# EAGLE design Can Bus Shield (EAGLE 7.7.0)
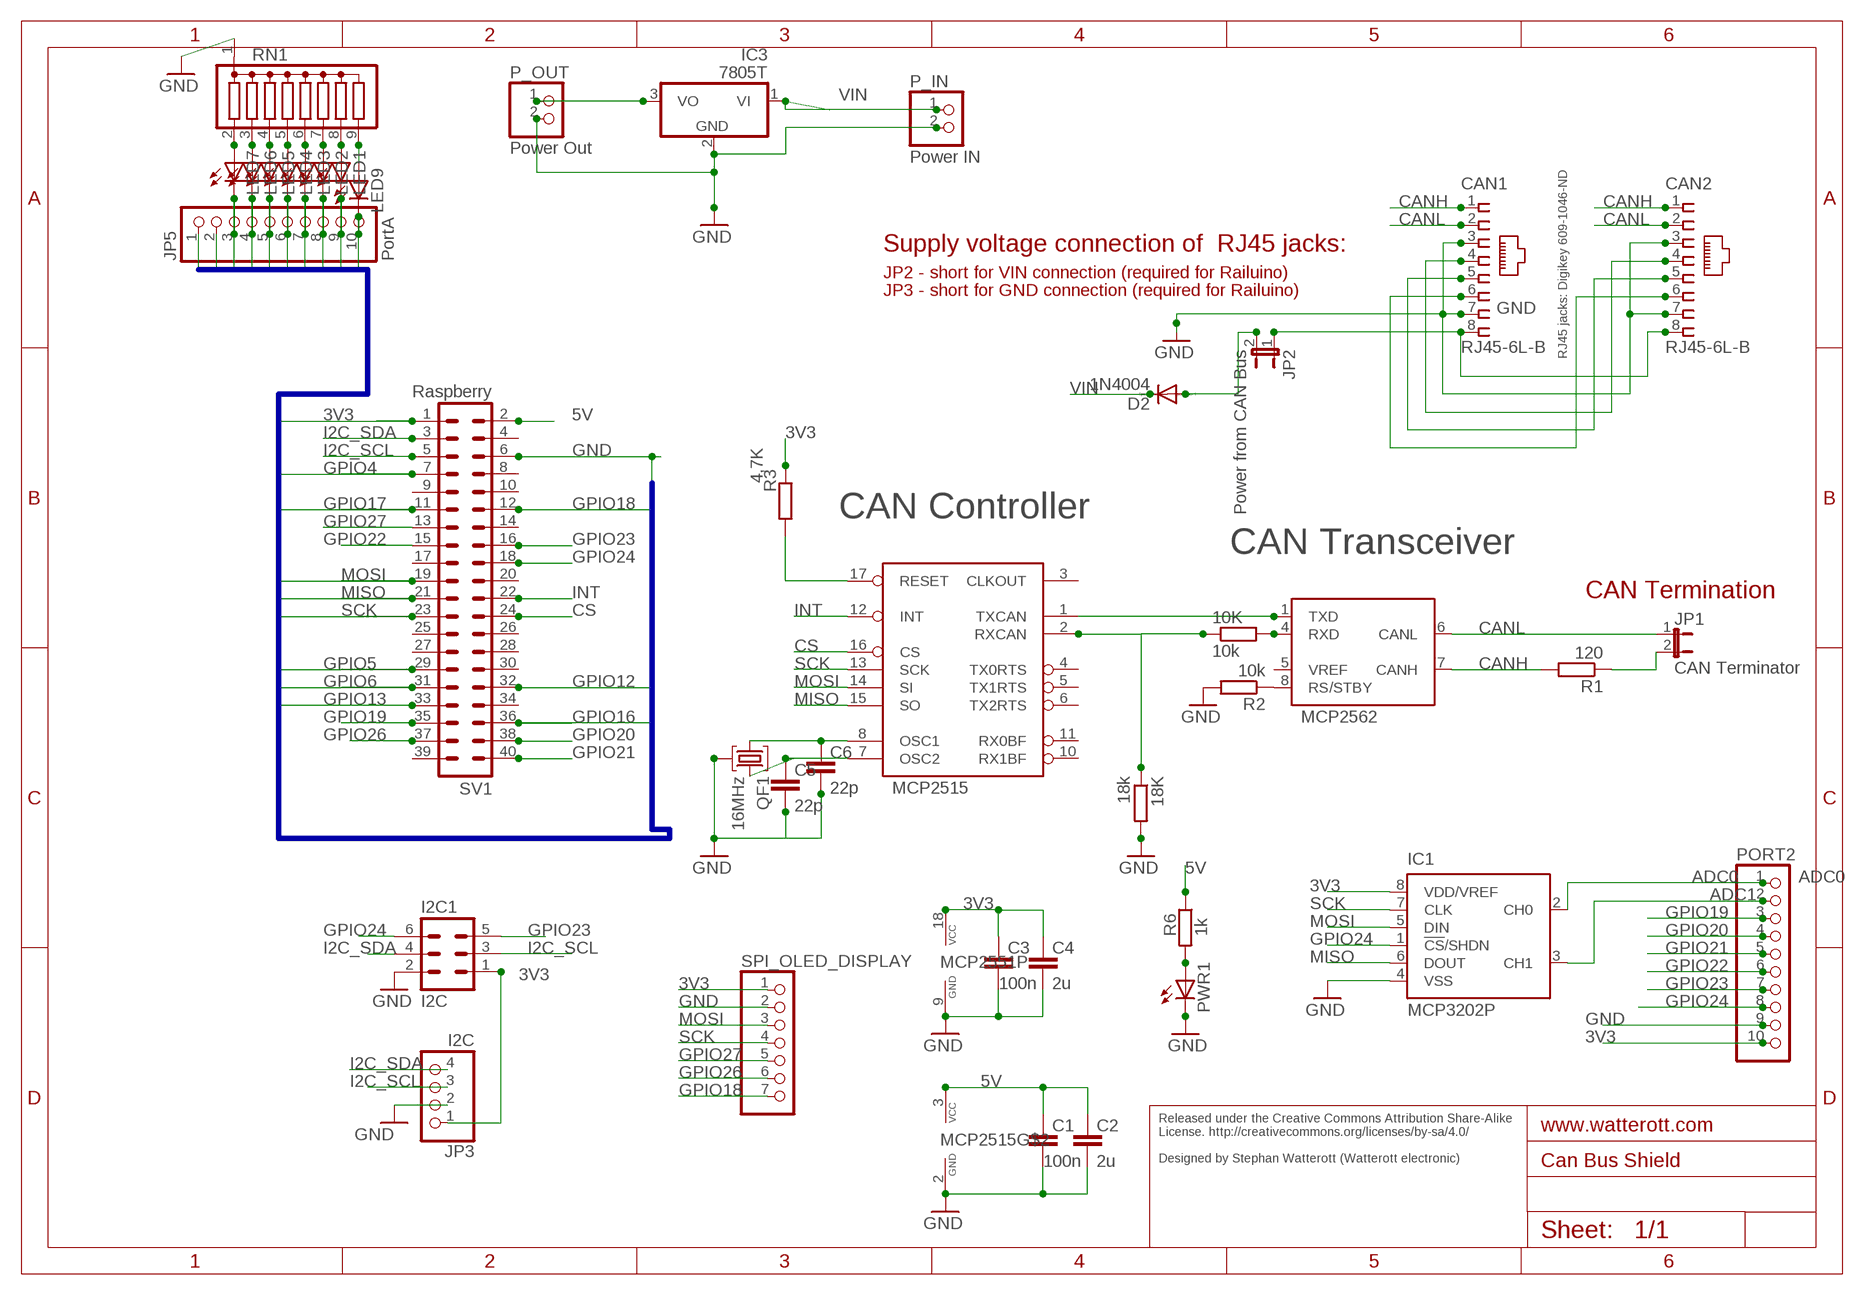
[diagram p0: schematic, sheet 1]

## Parts
10K  10k  R-EU_R2010  [R2010]
18K  18k  R-EU_R2010  [R2010]
C1  100n  C-EUC1812  [C1812]
C2  2u  C-EUC1812  [C1812]
C3  100n  C-EUC1812  [C1812]
C4  2u  C-EUC1812  [C1812]
C5  22p  C-EU025-030X050  [C025-030X050]
C6  22p  C-EU025-025X050  [C025-025X050]
CAN1  RJ45-6L-B  [RJ45-NO-SHIELD]
CAN2  RJ45-6L-B  [RJ45-NO-SHIELD]
D2  1N4004  [DO41-10]
I2C1  I2C  06H  [06H]
IC1  MCP3202P  [DIL8]
IC3  7805T  [TO220H]
JP1  CAN Terminator  JP1E  [JP1]
JP2  Power from CAN Bus  JP1E  [JP1]
JP3  I2C  PINHD-1X4  [1X04]
JP5  PortA  PINHD-1X10  [1X10]
LED1  LEDSML1206  [SML1206]
LED2  LEDSML1206  [SML1206]
LED3  LEDSML1206  [SML1206]
LED4  LEDSML1206  [SML1206]
LED5  LEDSML1206  [SML1206]
LED6  LEDSML1206  [SML1206]
LED7  LEDSML1206  [SML1206]
LED9  LEDSML1206  [SML1206]
MCP2515  MCP2562  MCP2551DIL8  [DIL08]
MCP2551  MCP2515  MCP2515P  [DIL18]
P_IN  Power IN  PINHD-1X2  [1X02]
P_OUT  Power Out  PINHD-1X2  [1X02]
PORT2  PINHD-1X10  [1X10]
PWR1  LEDSMT1206  [1206]
QF1  16MHz  10M7AHC49T  [HC49U]
R1  120  R-EU_R2010  [R2010]
R2  10k  R-EU_R2010  [R2010]
R3  4,7K  R-EU_R2010  [R2010]
R6  1k  R-EU_R2010  [R2010]
RN1  G08R  [SIL9]
SPI_OLED_DISPLAY  PINHD-1X7  [1X07]
SV1  Raspberry  ML40  [ML40]

## Nets
3V3: C3.1 C4.1 I2C1.1 IC1.8(VDD/VREF) JP3.1 JP5.1 MCP2551.18(P:VCC) PORT2.10 R3.1 SPI_OLED_DISPLAY.1 SV1.1
5V: C1.1 C2.1 IC3.3(VO) MCP2515.3(VCC) P_OUT.1 R6.1 SV1.2
ADC0: IC1.2(CH0) PORT2.1
ADC1: IC1.3(CH1) PORT2.2
CAN_TX: MCP2515.1(TXD) MCP2551.1(D:TXCAN)
CANH: CAN1.1 CAN2.1 MCP2515.7(CANH) R1.2
CANL: CAN1.2 CAN2.2 JP1.1 MCP2515.6(CANL)
CS: MCP2551.16(D:CS) SV1.24
GND: 18K.2 C1.2 C2.2 C3.2 C4.2 C5.2 C6.2 CAN1.3 CAN1.7 CAN2.3 CAN2.7 I2C1.2 IC1.4(VSS) IC3.2(GND) JP3.2 JP5.2 MCP2515.2(GND) MCP2551.9(P:GND) P_IN.2 P_OUT.2 PORT2.9 PWR1.C QF1.2 R2.2 RN1.1 SPI_OLED_DISPLAY.2 SV1.6
GPIO4: JP5.10 LED9.C SV1.7
GPIO5: JP5.9 LED1.C SV1.29
GPIO6: JP5.8 LED2.C SV1.31
GPIO12: JP5.7 LED3.C SV1.32
GPIO13: JP5.6 LED4.C SV1.33
GPIO16: JP5.5 LED5.C SV1.36
GPIO17: JP5.4 LED6.C SV1.11
GPIO18: JP5.3 LED7.C SPI_OLED_DISPLAY.7 SV1.12
GPIO19: PORT2.3 SV1.35
GPIO20: PORT2.4 SV1.38
GPIO21: PORT2.5 SV1.40
GPIO22: PORT2.6 SV1.15
GPIO23: I2C1.5 PORT2.7 SV1.16
GPIO24: I2C1.6 IC1.1(!CS!/SHDN) PORT2.8 SV1.18
GPIO26: SPI_OLED_DISPLAY.6 SV1.37
GPIO27: SPI_OLED_DISPLAY.5 SV1.13
I2C_SCL: I2C1.3 JP3.3 SV1.5
I2C_SDA: I2C1.4 JP3.4 SV1.3
INT: MCP2551.12(D:INT) SV1.22
MISO: IC1.6(DOUT) MCP2551.15(D:SO) SV1.21
MOSI: IC1.5(DIN) MCP2551.14(D:SI) SPI_OLED_DISPLAY.3 SV1.19
N$1: 10K.1 18K.1 MCP2551.2(D:RXCAN)
N$2: LED9.A RN1.9
N$3: LED1.A RN1.8
N$4: LED2.A RN1.7
N$5: LED3.A RN1.6
N$6: CAN1.8 CAN2.8 JP2.1
N$7: MCP2515.8(RS) R2.1
N$8: LED4.A RN1.5
N$9: JP1.2 R1.1
N$10: LED5.A RN1.4
N$11: LED6.A RN1.3
N$12: LED7.A RN1.2
N$13: MCP2551.17(D:RESET) R3.2
N$15: 10K.2 MCP2515.4(RXD)
N$22: PWR1.A R6.2
N$121: D2.A JP2.2
N$199: CAN1.4 CAN2.4
N$200: CAN1.5 CAN2.5
N$201: CAN1.6 CAN2.6
OSC1: C6.1 MCP2551.8(D:OSC1) QF1.1
OSC2: C5.1 MCP2551.7(D:OSC2) QF1.3
SCK: IC1.7(CLK) MCP2551.13(D:SCK) SPI_OLED_DISPLAY.4 SV1.23
VIN: D2.C IC3.1(VI) P_IN.1
Unconnected: MCP2515.5(VREF) MCP2551.3(D:CLKOUT) MCP2551.4(D:TX0RTS) MCP2551.5(D:TX1RTS) MCP2551.6(D:TX2RTS) MCP2551.10(D:RX1BF) MCP2551.11(D:RX0BF) SV1.4 SV1.8 SV1.9 SV1.10 SV1.14 SV1.17 SV1.20 SV1.25 SV1.26 SV1.27 SV1.28 SV1.30 SV1.34 SV1.39

## Buses
GPIO4,GPIO5,GPIO6,GPIO12,GPIO13,GPIO16,GPIO17,GPIO18,MOSI,MISO,SCK,GND,3V3

## Notes on the sheet
- Supply voltage connection of  RJ45 jacks:
- JP2 - short for VIN connection (required for Railuino)
- JP3 - short for GND connection (required for Railuino)
- RJ45 jacks: Digikey 609-1046-ND
- CAN Controller
- CAN Transceiver
- CAN Termination
- /STBY
- Released under the Creative Commons Attribution Share-Alike 
  License. http://creativecommons.org/licenses/by-sa/4.0/
  
  Designed by Stephan Watterott (Watterott electronic)

## Library data of the parts
10K 18K R1 R2 = resistor:R-EU_: RESISTOR, European symbol
C1-C6 = resistor:C-EU: CAPACITOR, European symbol
CAN1 CAN2 = con-tycoelectronics:RJ45: CORCOM Modular RJ Jacks No Shield Source: www.tycoelectronics.com .. ENG_DS_1654001_1099_RJ_L_0507.pdf; MPN: RJ45-6L-B; OC_FARNELL: unknown; OC_NEWARK: 16R6090
D2 = diode:1N4004: DIODE general purpose rectifier, 1 A
I2C1 = con-harting-h:06H: CONNECTOR; OC_FARNELL: unknown; OC_NEWARK: unknown
IC1 = microchip:MCP3202: 2.7V Dual Channel 12-Bit A/D Converter with SPI Serial Interface Source: http://ww1.microchip.com/downloads/en/DeviceDoc/21034D.pdf; MF: MICROCHIP; MPN: MCP3202-CI/P; OC_FARNELL: 1196794; OC_NEWARK: 72K7287
IC3 = linear:78*: Positive VOLTAGE REGULATOR Source: http://cache.national.com/ds/LM/LM78L05.pdf http://www.fairchildsemi.com/ds/LM/LM7805.pdf
JP1 JP2 = jumper:JP1E: JUMPER
JP3 = pinhead:PINHD-1X4: PIN HEADER
JP5 PORT2 = pinhead:PINHD-1X10: PIN HEADER
LED1-LED7 LED9 PWR1 = led:LED: LED OSRAM: - CHIPLED LG R971, LG N971, LY N971, LG Q971, LY Q971, LO R971, LY R971 LH N974, LH R974 LS Q976, LO Q976, LY Q976 LO Q996 - Hyper CHIPLED LW Q18S LB Q993, LB Q99A, LB R99A - SideLED LS A670, LO A670, LY A670, LG A670, LP A670 LB A673, LV A673, LT A673, LW A673 LH A674 LY A675 LS A676, LA A676, LO A676, LY A676, LW A676 LS A679, LY A679, LG A679 - Hyper Micro SIDELED® LS Y876, LA Y876, LO Y876, LY Y876 LT Y87S - SmartLED LW L88C, LW L88S LB L89C, LB L89S, LG L890 LS L89K, LO L89K, LY L89K LS L896, LA L896, LO L896, LY L896 - TOPLED LS T670, LO T670, LY T670, LG T670, LP T670 LSG T670, LSP T670, LSY T670, LOP T670, LYG T670 LG T671, LOG T671, LSG T671 LB T673, LV T673, LT T673, LW T673 LH T674 LS T676, LA T676, LO T676, LY T676, LB T676, LH T676, LSB T676, LW T676 LB T67C, LV T67C, LT T67C, LS T67K, LO T67K, LY T67K, LW E67C LS E67B, LA E67B, LO E67B, LY E67B, LB E67C, LV E67C, LT E67C LW T67C LS T679, LY T679, LG T679 LS T770, LO T770, LY T770, LG T770, LP T770 LB T773, LV T773, LT T773, LW T773 LH T774 LS E675, LA E675, LY E675, LS T675 LS T776, LA T776, LO T776, LY T776, LB T776 LHGB T686 LT T68C, LB T68C - Hyper Mini TOPLED® LB M676 - Mini TOPLED Santana® LG M470 LS M47K, LO M47K, LY M47K Source: http://www.osram.convergy.de LUXEON: - LUMILED® LXK2-PW12-R00, LXK2-PW12-S00, LXK2-PW14-U00, LXK2-PW14-V00 LXK2-PM12-R00, LXK2-PM12-S00, LXK2-PM14-U00 LXK2-PE12-Q00, LXK2-PE12-R00, LXK2-PE12-S00, LXK2-PE14-T00, LXK2-PE14-U00 LXK2-PB12-K00, LXK2-PB12-L00, LXK2-PB12-M00, LXK2-PB14-N00, LXK2-PB14-P00, LXK2-PB14-Q00 LXK2-PR12-L00, LXK2-PR12-M00, LXK2-PR14-Q00, LXK2-PR14-R00 LXK2-PD12-Q00, LXK2-PD12-R00, LXK2-PD12-S00 LXK2-PH12-R00, LXK2-PH12-S00 LXK2-PL12-P00, LXK2-PL12-Q00, LXK2-PL12-R00 Source: www.luxeon.com KINGBRIGHT: KA-3528ASYC Source: www.kingbright.com
MCP2515 = can:MCP2551: CAN Tranceiver Microchip
MCP2551 = can:MCP2515: MC2515 Stand-Alone CAN Controller With SPI Interface, Microchip
P_IN P_OUT = pinhead:PINHD-1X2: PIN HEADER
QF1 = crystal:10M*A: Monolithic Crystal Filters Source: www.vanlong.com; OC_FARNELL: unknown; OC_NEWARK: unknown
R3 R6 = rcl:R-EU_: RESISTOR, European symbol
RN1 = resistor-sil:G08R: SIL RESISTOR; OC_FARNELL: unknown; OC_NEWARK: unknown
SPI_OLED_DISPLAY = pinhead:PINHD-1X7: PIN HEADER
SV1 = con-harting-ml:ML40: HARTING; OC_FARNELL: unknown; OC_NEWARK: unknown

## Board
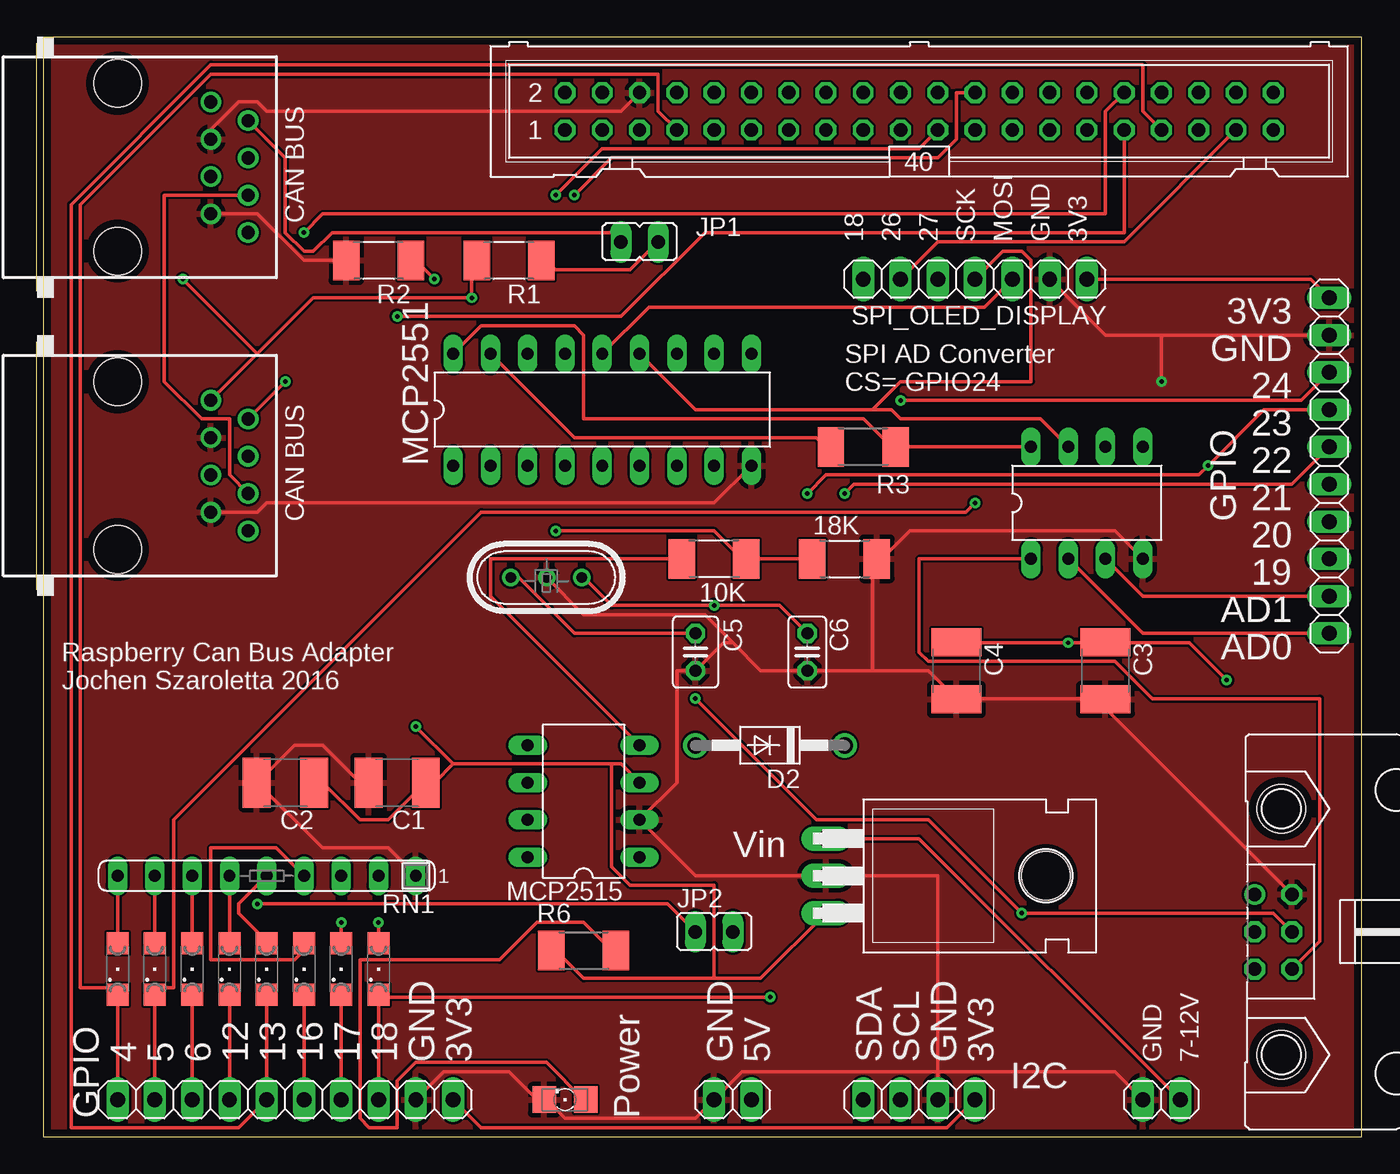
[diagram p1: board, top side]
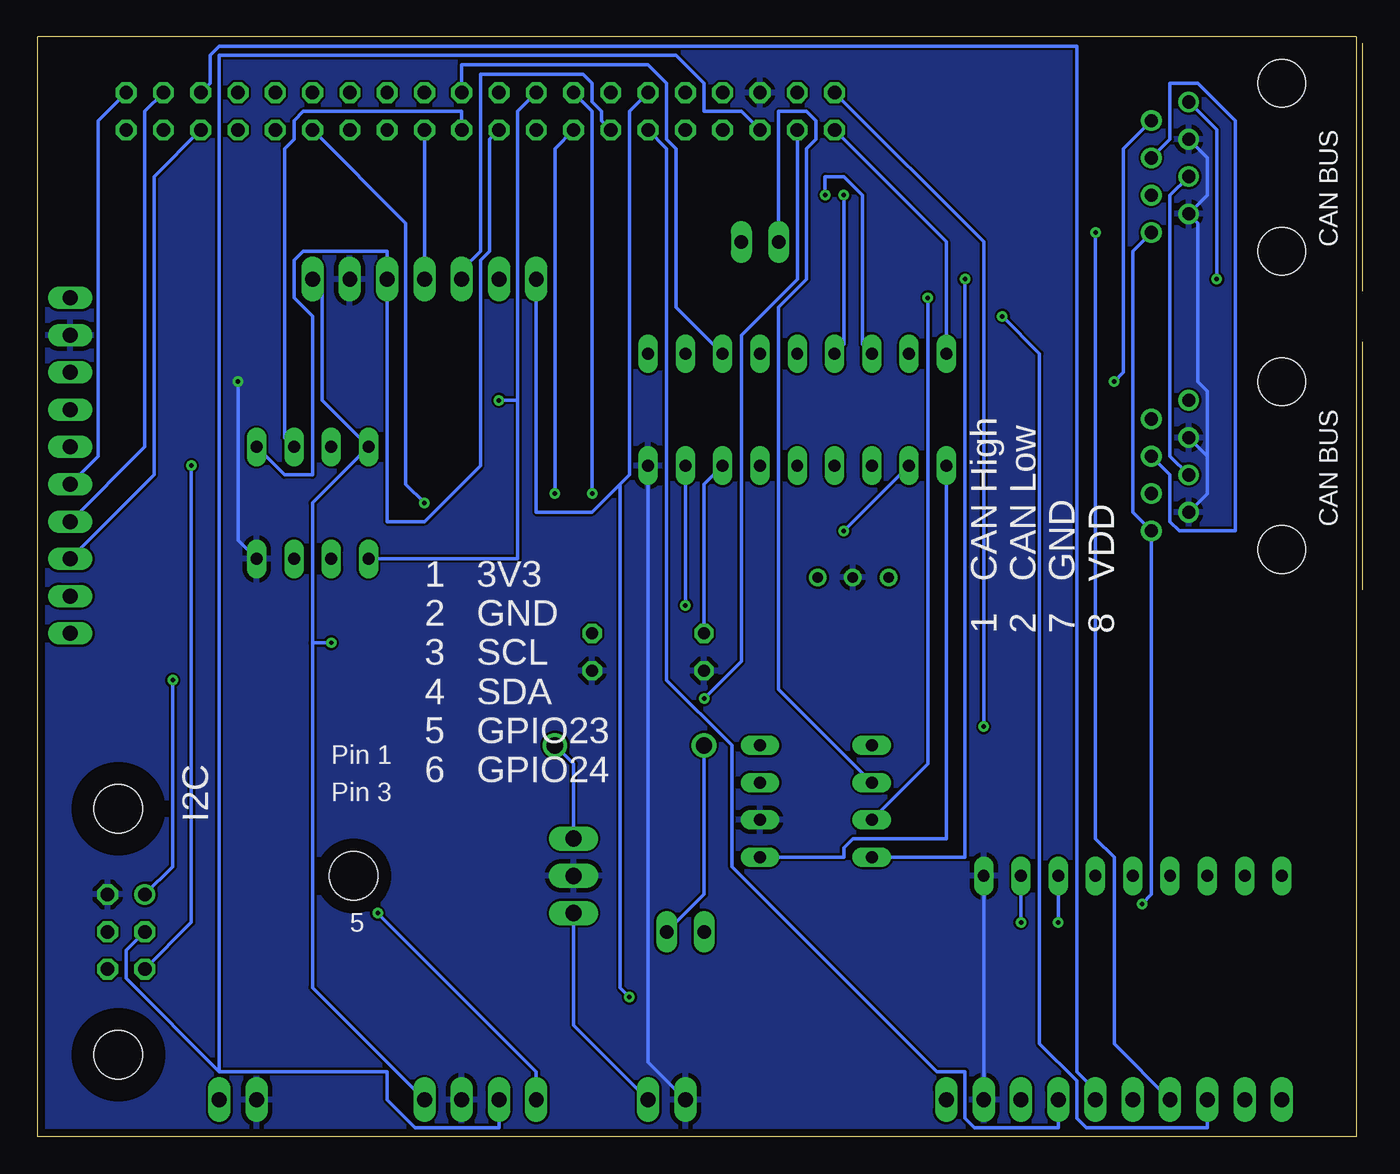
[diagram p2: board, bottom side, seen from below]

Size 90.27 x 74.93 mm. Coordinates in mm from the lower left corner, seen from the top.
Outline: 90.27,74.92 90.27,0 0.43,0 0.43,74.92
Outline: 0.43,74.93 90.27,74.93
Copper layers (1*16): Top 0.035mm / dielectric 1.6mm / Bottom 0.035mm
Design rules "Elecrow_2-layer_PCB_eagle_rule_Jochen1": minimum track width 10mil, minimum drill 12mil, track to track 6mil, track to pad 6mil, pad to pad 6mil, via to via 10mil, smd to smd 0mil, copper to edge 20mil, drill to drill 10mil, minimum pad ring 10mil, minimum via ring 8mil, stop-mask expansion 0mil, vias tented up to drill 100mil, thermal gap 12mil
vRestrict: area 33.5,64.8 to 86.8,72.4; area 84.3,34.3 to 90.6,59.7; area 3,5.1 to 30.9,11.4; area 43.6,5.1 to 51.2,8.9; area 52.5,5.1 to 60.1,8.9; area 60.1,5.1 to 67.7,8.9; area 9.3,59.7 to 15.7,72.4; area 10.6,39.4 to 15.7,52.1; area 81.7,10.2 to 86.8,19.1; area 27.1,43.2 to 50,55.9; area 51.2,12.7 to 57.6,22.9; area 65.2,36.8 to 76.6,49.5; area 43.6,0 to 67.7,5.1; area 80.4,31.8 to 85.5,59.7; area 50,59.7 to 69,64.8; area 37.3,62.2 to 53.8,64.8; area 3,8.9 to 27.1,14; area 1.7,29.2 to 30.9,34.3; area 15.7,62.2 to 19.5,72.4; area 15.7,40.6 to 19.5,50.8; area 29.6,15.2 to 43.6,19.1; area 72.8,5.1 to 80.4,10.2; area 52.5,44.5 to 60.1,48.3; area 70.3,10.2 to 80.4,14; area 53.8,50.8 to 72.8,57.2; area 42.3,10.2 to 65.2,12.7; area 38.5,0 to 42.3,8.9

### Footprints (pad centres in the part's own frame; a part is rotated, then mirrored left to right if it is on the bottom)
R2010 = smd 1.8 x 2.7: 1 -2.2,0; 2 2.2,0
C1812 = smd 1.9 x 3.4: 1 -1.95,0; 2 1.95,0
C025-030X050 = drill 0.813 octagon: 1 -1.27,0; 2 1.27,0
C025-025X050 = drill 0.813 octagon: 1 -1.27,0; 2 1.27,0
RJ45-NO-SHIELD = drill 0.9 pad 1.4: 1 -4.445,6.35; 2 -3.175,8.89; 3 -1.905,6.35; 4 -0.635,8.89; 5 0.635,6.35; 6 1.905,8.89; 7 3.175,6.35; 8 4.445,8.89 | hole 3.251: -5.715,0; 5.715,0
DO41-10 = drill 1.118: A 5.08,0; C -5.08,0
06H = drill 0.914: 1 -2.54,-1.27 | drill 0.914 octagon: 2 -2.54,1.27; 3 0,-1.27; 4 0,1.27; 5 2.54,-1.27; 6 2.54,1.27 | hole 3.302: -8.382,0.533; 8.382,0.533
DIL8 = drill 0.813 long: 1 -3.81,-3.81; 2 -1.27,-3.81; 3 1.27,-3.81; 4 3.81,-3.81; 5 3.81,3.81; 6 1.27,3.81; 7 -1.27,3.81; 8 -3.81,3.81
TO220H = drill 1.118 long: 1 -2.54,-10.16; 2 0,-10.16; 3 2.54,-10.16 | hole 3.302: 0,4.826
JP1 = drill 0.914 long: 1 0,-1.27; 2 0,1.27
1X04 = drill 1.016 long: 1 -3.81,0; 2 -1.27,0; 3 1.27,0; 4 3.81,0
1X10 = drill 1.016 long: 1 -11.43,0; 2 -8.89,0; 3 -6.35,0; 4 -3.81,0; 5 -1.27,0; 6 1.27,0; 7 3.81,0; 8 6.35,0; 9 8.89,0; 10 11.43,0
SML1206 = smd 1.5 x 1.5: A 1.75,0; C -1.75,0
DIL08 = drill 0.813 long: 1 -3.81,-3.81; 2 -1.27,-3.81; 3 1.27,-3.81; 4 3.81,-3.81; 5 3.81,3.81; 6 1.27,3.81; 7 -1.27,3.81; 8 -3.81,3.81
DIL18 = drill 0.813 long: 1 -10.16,-3.81; 2 -7.62,-3.81; 3 -5.08,-3.81; 4 -2.54,-3.81; 5 0,-3.81; 6 2.54,-3.81; 7 5.08,-3.81; 8 7.62,-3.81; 9 10.16,-3.81; 10 10.16,3.81; 11 7.62,3.81; 12 5.08,3.81; 13 2.54,3.81; 14 0,3.81; 15 -2.54,3.81; 16 -5.08,3.81; 17 -7.62,3.81; 18 -10.16,3.81
1X02 = drill 1.016 long: 1 -1.27,0; 2 1.27,0
1206 = smd 1.6 x 1.803: A -1.422,0; C 1.422,0
HC49U = drill 0.7 pad 1.2: 1 -2.413,0; 2 -0.027,0; 3 2.413,0
SIL9 = drill 0.813 long: 1 -10.16,0; 2 -7.62,0; 3 -5.08,0; 4 -2.54,0; 5 0,0; 6 2.54,0; 7 5.08,0; 8 7.62,0; 9 10.16,0
1X07 = drill 1.016 long: 1 -7.62,0; 2 -5.08,0; 3 -2.54,0; 4 0,0; 5 2.54,0; 6 5.08,0; 7 7.62,0
ML40 = drill 0.914 octagon: 1 -24.13,-1.27; 2 -24.13,1.27; 3 -21.59,-1.27; 4 -21.59,1.27; 5 -19.05,-1.27; 6 -19.05,1.27; 7 -16.51,-1.27; 8 -16.51,1.27; 9 -13.97,-1.27; 10 -13.97,1.27; 11 -11.43,-1.27; 12 -11.43,1.27; 13 -8.89,-1.27; 14 -8.89,1.27; 15 -6.35,-1.27; 16 -6.35,1.27; 17 -3.81,-1.27; 18 -3.81,1.27; 19 -1.27,-1.27; 20 -1.27,1.27; 21 1.27,-1.27; 22 1.27,1.27; 23 3.81,-1.27; 24 3.81,1.27; 25 6.35,-1.27; 26 6.35,1.27; 27 8.89,-1.27; 28 8.89,1.27; 29 11.43,-1.27; 30 11.43,1.27; 31 13.97,-1.27; 32 13.97,1.27; 33 16.51,-1.27; 34 16.51,1.27; 35 19.05,-1.27; 36 19.05,1.27; 37 21.59,-1.27; 38 21.59,1.27; 39 24.13,-1.27; 40 24.13,1.27

### Placement (x,y rotation side)
10K  46.15,39.37 180 top
18K  55.04,39.37 0 top
C1  24.56,24.13 180 top
C2  16.94,24.13 180 top
C3  72.82,31.75 270 top
C4  62.66,31.75 270 top
C5  44.88,33.02 270 top
C6  52.5,33.02 270 top
CAN1  5.51,45.72 270 top
CAN2  5.51,66.04 270 top
D2  49.96,26.67 180 top
I2C1  84.25,13.97 270 top
IC1  71.55,43.18 0 top
IC3  63.93,17.78 270 top
JP1  41.07,60.96 270 top
JP2  46.15,13.97 270 top
JP3  60.12,2.54 180 top
JP5  16.94,2.54 180 top
LED1  8.05,11.43 90 top
LED2  10.59,11.43 90 top
LED3  13.13,11.43 90 top
LED4  15.67,11.43 90 top
LED5  18.21,11.43 90 top
LED6  20.75,11.43 90 top
LED7  23.29,11.43 90 top
LED9  5.51,11.43 90 top
MCP2515  37.26,22.86 90 top
MCP2551  38.53,49.53 0 top
P_IN  76.63,2.54 180 top
P_OUT  47.42,2.54 180 top
PORT2  88.06,45.72 90 top
PWR1  35.99,2.54 180 top
QF1  34.72,38.1 180 top
R1  32.18,59.69 180 top
R2  23.29,59.69 180 top
R3  56.31,46.99 180 top
R6  37.26,12.7 0 top
RN1  15.67,17.78 180 top
SPI_OLED_DISPLAY  63.93,58.42 180 top
SV1  60.12,69.85 0 top

### Tracks (layer width: path | path; a pad name or v marks a point on that pad's centre or on a via)
3V3  (via drill 0.3)
  Top 0.254: v81.08,31.12 78.54,33.66 72.82,33.66 | 72.82,33.66 v70.28,33.66 62.66,33.66 C4.1 | 72.82,33.66 C3.1 | JP5.1 30.28,0.63 62.03,0.63 JP3.1 | IC1.8 R3.1 58.22,46.99 56.31,48.89 37.26,48.89 37.26,54.61 36.63,55.25 30.28,55.25 MCP2551.18 | PORT2.10 86.79,58.42 SPI_OLED_DISPLAY.1
  Bottom 0.254: I2C1.1 81.08,18.41 v81.08,31.12 | MCP2551.18 28.37,60.96 SV1.1 | SPI_OLED_DISPLAY.1 70.92,57.78 70.92,50.16 IC1.8 71.55,43.18 71.55,33.66 | JP3.1 71.55,10.16 71.55,33.66 | 71.55,33.66 v70.28,33.66
5V  (via drill 0.3)
  Top 0.254: 46.15,10.79 49.33,10.79 IC3.3 | 46.15,10.79 37.26,10.79 35.36,12.7 R6.1 | MCP2515.3 39.8,25.4 39.17,25.4 | 28.37,25.4 39.17,25.4 | 28.37,25.4 27.1,24.13 C1.1 26.47,24.13 23.93,21.59 22.02,21.59 19.48,24.13 C2.1 | 28.37,25.4 v25.83,27.94 | 46.15,10.79 46.15,17.14 40.44,17.14 39.17,18.41 39.17,25.4
  Bottom 0.254: P_OUT.1 53.77,7.62 IC3.3 | SV1.2 25.83,60.96 v25.83,27.94
ADC0
  Top 0.254: IC1.2 75.36,34.29 PORT2.1
ADC1
  Top 0.254: IC1.3 75.36,36.83 PORT2.2
CAN_TX
  Bottom 0.254: MCP2515.1 35.36,19.05 35.36,19.68 34.72,20.32 28.37,20.32 MCP2551.1
CANH  (via drill 0.3)
  Top 0.254: R1.2 29.64,59.69 v29.64,57.15 18.85,57.15 15.04,53.34 | 15.04,53.34 CAN1.1 | 15.04,53.34 v9.96,58.42
  Bottom 0.254: MCP2515.7 29.64,25.4 v29.64,57.15 | CAN2.1 9.96,68.58 v9.96,58.42
CANL  (via drill 0.3)
  Top 0.254: v16.94,51.44 CAN1.2 | CAN2.2 16.94,66.67 16.94,61.59 18.21,60.33 18.85,60.33 20.12,61.59 39.17,61.59 JP1.1
  Bottom 0.254: v16.94,51.44 16.31,52.07 16.31,67.31 CAN2.2 | MCP2515.6 39.8,30.48 39.8,56.52 37.9,58.42 37.9,67.31 37.26,67.94 37.26,69.22 37.9,69.85 39.8,69.85 JP1.1
CS  (via drill 0.3)
  Top 0.254: v36.63,64.14 39.17,66.67 61.39,66.67 62.66,67.94 62.66,71.12 SV1.24
  Bottom 0.254: MCP2551.16 34.09,53.98 34.09,64.14 35.36,65.41 36.63,65.41 v36.63,64.14
GND  (via drill 0.3)
  Top 0.254: R2.2 18.21,59.69 15.04,62.86 CAN2.7 | SV1.6 39.8,69.85 15.67,69.85 15.04,70.48 13.77,70.48 11.86,68.58 CAN2.3 | MCP2551.9 46.15,43.18 15.67,43.18 15.04,42.55 CAN1.7 | 15.04,24.13 17.58,26.67 19.48,26.67 22.02,24.13 C1.2 | JP5.2 27.74,4.45 32.18,4.45 34.09,2.54 PWR1.C 34.72,2.54 35.99,1.27 44.88,1.27 P_OUT.2 48.06,4.45 61.39,4.45 | 15.04,24.13 19.48,19.68 23.93,19.68 RN1.1 | 15.04,24.13 C2.2 | 61.39,4.45 61.39,17.78 IC3.2 44.88,17.78 MCP2515.2 43.61,24.13 43.61,31.75 C5.2 46.79,33.66 47.42,33.66 | 61.39,4.45 JP3.2 | P_IN.2 73.46,4.45 61.39,4.45 | I2C1.2 72.82,29.21 C3.2 72.82,29.84 62.66,29.84 | SPI_OLED_DISPLAY.2 72.82,54.61 76.63,54.61 | PORT2.9 76.63,54.61 | IC1.4 73.46,41.27 59.49,41.27 57.58,39.37 18K.2 56.95,39.37 56.95,31.75 | 47.42,33.66 49.33,31.75 C6.2 56.95,31.75 | 47.42,33.66 45.52,35.56 37.26,35.56 34.72,38.1 QF1.2 | v76.63,51.44 76.63,54.61 | 62.66,29.84 60.76,31.75 56.95,31.75 | 62.66,29.84 C4.2
  Bottom 0.254: CAN2.3 10.59,66.67 10.59,64.14 CAN2.7 11.23,62.23 11.23,51.44 10.59,50.8 10.59,46.35 | 10.59,46.35 CAN1.3 | 10.59,46.35 10.59,43.81 CAN1.7 | JP5.2 RN1.1 | v76.63,51.44 76.63,40.64 IC1.4 | MCP2551.9 48.69,5.08 P_OUT.2
  pour Bottom: 0.43,74.93 90.6,74.93 90.6,0 0.43,0
  pour Top: 0.43,74.93 90.6,74.93 90.6,0 0.43,0 0.43,1.27
GPIO4
  Top 0.254: JP5.10 LED9.C 5.51,10.16 2.97,10.16 2.97,63.5 11.86,72.39 42.34,72.39 42.34,69.85 SV1.7
GPIO5  (via drill 0.3)
  Top 0.254: JP5.9 LED1.C 8.05,10.16 9.32,10.16 9.32,21.59 30.28,42.55 63.3,42.55 v63.93,43.18
  Bottom 0.254: SV1.29 65.2,62.23 65.2,44.45 v63.93,43.18
GPIO6  (via drill 0.3)
  Top 0.254: JP5.8 LED2.C | SV1.31 74.09,61.59 45.52,61.59 39.8,55.88 v24.56,55.88
  Bottom 0.254: v24.56,55.88 22.02,53.34 22.02,6.35 19.48,3.81 19.48,1.27 18.85,0.63 10.59,0.63 JP5.8
GPIO12  (via drill 0.3)
  Top 0.254: JP5.7 LED3.C | SV1.32 72.82,69.85 72.82,62.86 19.48,62.86 v18.21,61.59
  Bottom 0.254: v18.21,61.59 18.21,20.32 16.94,19.05 16.94,6.35 JP5.7
GPIO13
  Top 0.254: LED4.C JP5.6 13.77,0.63 2.34,0.63 2.34,63.5 11.86,73.03 75.36,73.03 75.36,69.85 SV1.33
GPIO16
  Top 0.254: JP5.5 LED5.C
  Bottom 0.254: SV1.36 78.54,71.75 78.54,73.66 77.9,74.3 19.48,74.3 19.48,4.45 18.21,3.17 JP5.5
GPIO17
  Top 0.254: JP5.4 LED6.C
  Bottom 0.254: SV1.11 47.42,67.31 47.42,31.12 42.98,26.67 42.98,18.41 29.01,4.45 27.1,4.45 27.1,1.27 26.47,0.63 20.75,0.63 JP5.4
GPIO18  (via drill 0.3)
  Top 0.254: JP5.3 23.29,9.52 | v49.96,9.52 23.29,9.52 | 23.29,9.52 LED7.C
  Bottom 0.254: SV1.12 49.96,69.85 49.96,45.09 50.6,44.45 | 50.6,44.45 52.5,42.55 56.31,42.55 SPI_OLED_DISPLAY.7 | v49.96,9.52 50.6,10.16 50.6,44.45
GPIO19
  Bottom 0.254: SV1.35 82.35,65.41 82.35,45.09 PORT2.3
GPIO20
  Bottom 0.254: SV1.38 82.98,69.85 82.98,46.99 PORT2.4
GPIO21
  Bottom 0.254: SV1.40 86.16,69.22 86.16,46.35 PORT2.5
GPIO22  (via drill 0.3)
  Top 0.254: v55.04,43.81 55.68,44.45 85.52,44.45 PORT2.6
  Bottom 0.254: SV1.15 55.04,67.31 v55.04,43.81
GPIO23  (via drill 0.3)
  Top 0.254: PORT2.7 83.62,49.53 v79.81,45.72 79.17,45.09 53.77,45.09 v52.5,43.81
  Bottom 0.254: I2C1.5 79.81,14.61 v79.81,45.72 | SV1.16 52.5,69.85 v52.5,43.81
GPIO24  (via drill 0.3)
  Top 0.254: I2C1.6 87.43,13.34 87.43,29.84 76,29.84 73.46,32.38 60.76,32.38 60.12,33.02 60.12,39.37 IC1.1 | PORT2.8 86.16,50.16 v58.85,50.16
  Bottom 0.254: IC1.1 57.58,39.37 57.58,50.16 | 57.58,50.16 57.58,69.85 SV1.18 | 57.58,50.16 v58.85,50.16
GPIO26
  Top 0.254: SV1.37 74.09,60.96 61.39,60.96 SPI_OLED_DISPLAY.6
GPIO27
  Bottom 0.254: SV1.13 51.87,69.22 51.87,69.85 52.5,70.48 52.5,71.75 53.14,72.39 60.12,72.39 60.12,60.33 61.39,59.05 SPI_OLED_DISPLAY.5
I2C_SCL
  Bottom 0.254: I2C1.3 84.25,12.7 84.25,10.79 77.9,4.45 | 77.9,4.45 66.47,4.45 66.47,2.54 64.57,0.63 58.85,0.63 JP3.3 | SV1.5 42.34,69.85 44.88,69.85 44.88,71.75 46.79,73.66 77.9,73.66 77.9,4.45
I2C_SDA  (via drill 0.3)
  Top 0.254: I2C1.4 84.25,15.24 v67.11,15.24 60.76,21.59 53.14,21.59 v44.88,29.84
  Bottom 0.254: v67.11,15.24 56.31,4.45 JP3.4 | SV1.3 38.53,58.42 42.34,54.61 42.34,32.38 v44.88,29.84
INT
  Bottom 0.254: MCP2551.12 46.79,56.52 46.79,67.31 47.42,67.94 47.42,71.75 48.69,73.03 61.39,73.03 SV1.22
MISO  (via drill 0.3)
  Top 0.254: v35.36,64.14 38.53,67.31 60.12,67.31 SV1.21
  Bottom 0.254: MCP2551.15 35.36,53.98 v35.36,64.14 | IC1.6 73.46,47.62 73.46,67.31 72.82,67.94 72.82,69.22 72.19,69.85 61.39,69.85 SV1.21
MOSI
  Top 0.254: MCP2551.14 41.71,56.52 64.57,56.52 SPI_OLED_DISPLAY.3
  Bottom 0.254: IC1.5 73.46,45.09 71.55,45.09 71.55,55.88 72.82,57.15 72.82,59.69 72.19,60.33 66.47,60.33 SPI_OLED_DISPLAY.3 66.47,41.91 63.93,41.91 60.12,45.72 60.12,59.69 59.49,60.33 59.49,67.94 SV1.19
N$1  (via drill 0.3)
  Top 0.254: v35.36,41.27 46.15,41.27 48.06,39.37 10K.1 18K.1
  Bottom 0.254: v35.36,41.27 MCP2551.2
N$2
  Top 0.254: RN1.9 LED9.A
N$3
  Top 0.254: RN1.8 LED1.A
N$4
  Top 0.254: RN1.7 LED2.A
N$5
  Top 0.254: RN1.6 LED3.A
N$6  (via drill 0.3)
  Top 0.254: JP2.1 42.98,15.88 v15.04,15.88
  Bottom 0.254: CAN2.8 15.67,60.33 15.67,42.55 CAN1.8 14.4,16.51 v15.04,15.88
N$7  (via drill 0.3)
  Top 0.254: v27.1,58.42 25.83,59.69 R2.1
  Bottom 0.254: MCP2515.8 27.1,19.05 v27.1,58.42
N$8
  Top 0.254: RN1.5 13.77,15.88 13.77,15.24 15.67,13.34 LED4.A
N$9
  Top 0.254: JP1.2 40.44,59.05 35.36,59.05 34.72,59.69 R1.1
N$10
  Top 0.254: RN1.4 16.31,19.68 11.86,19.68 11.86,12.06 17.58,12.06 18.21,12.7 LED5.A
N$11  (via drill 0.3)
  Top 0.254: v20.75,14.61 LED6.A
  Bottom 0.254: RN1.3 v20.75,14.61
N$12  (via drill 0.3)
  Top 0.254: v23.29,14.61 LED7.A
  Bottom 0.254: RN1.2 v23.29,14.61
N$13
  Top 0.254: MCP2551.17 36.63,47.62 53.14,47.62 53.77,46.99 R3.2
N$15
  Top 0.254: MCP2515.4 30.91,36.83 30.91,39.37 10K.2
N$22
  Top 0.254: PWR1.A 37.26,2.54 34.72,5.08 25.83,5.08 24.56,3.81 24.56,0.63 22.66,0.63 22.02,1.27 22.02,12.06 31.55,12.06 34.09,14.61 37.26,14.61 39.17,12.7 R6.2
N$121
  Bottom 0.254: JP2.2 44.88,16.51 D2.A
N$199
  Bottom 0.254: CAN1.4 13.13,45.09 13.13,41.91 12.5,41.27 8.69,41.27 8.69,69.22 11.23,71.75 13.13,71.75 13.13,67.94 CAN2.4
N$200
  Bottom 0.254: CAN1.5 13.13,46.35 13.13,64.14 CAN2.5
N$201
  Top 0.254: CAN1.6 13.13,45.09 13.13,48.89 11.23,48.89 8.69,51.44 8.69,64.14 CAN2.6
OSC1  (via drill 0.3)
  Top 0.254: C6.1 50.6,36.2 v46.15,36.2 39.17,36.2 37.26,38.1 QF1.1
  Bottom 0.254: v46.15,36.2 MCP2551.8
OSC2
  Top 0.254: C5.1 36.63,34.29 32.82,38.1 QF1.3
  Bottom 0.254: MCP2551.7 44.88,44.45 C5.1
SCK
  Top 0.254: MCP2551.13 44.88,49.53 56.95,49.53 | 56.95,49.53 58.22,49.53 58.85,48.89 68.38,48.89 IC1.7 | SPI_OLED_DISPLAY.4 65.84,60.33 67.11,60.33 67.74,59.69 67.74,51.44 58.85,51.44 56.95,49.53
  Bottom 0.254: SPI_OLED_DISPLAY.4 SV1.23
VIN
  Top 0.254: P_IN.1 60.12,20.32 IC3.1
  Bottom 0.254: D2.C 53.77,25.4 IC3.1

### Text on the board
tNames: CAN BUS | 18 | 26 | 27 | SCK | MOSI | GND | 3V3 | 3V3 | GND | 24 | SPI AD Converter / CS= GPIO24 | 23 | 22 | 21 | CAN BUS | GPIO | 20 | 19 | AD1 | AD0 | Raspberry Can Bus Adapter / Jochen Szaroletta 2016 | Vin | 4 | 5 | 6 | 12 | 13 | 16 | 17 | 18 | GND | 3V3 | GND | 5V | SDA | SCL | GND | 3V3 | I2C | GND | 7-12V | GPIO | Power
bNames: CAN BUS | CAN BUS | 1 CAN High / 2 CAN Low / 7 GND / 8 VDD | Pin 1 | I2C | 1 3V3 / 2 GND / 3 SCL / 4 SDA / 5 GPIO23 / 6 GPIO24 | Pin 3 | 5